# EAGLE design ch340_usb (EAGLE 9.6.2)
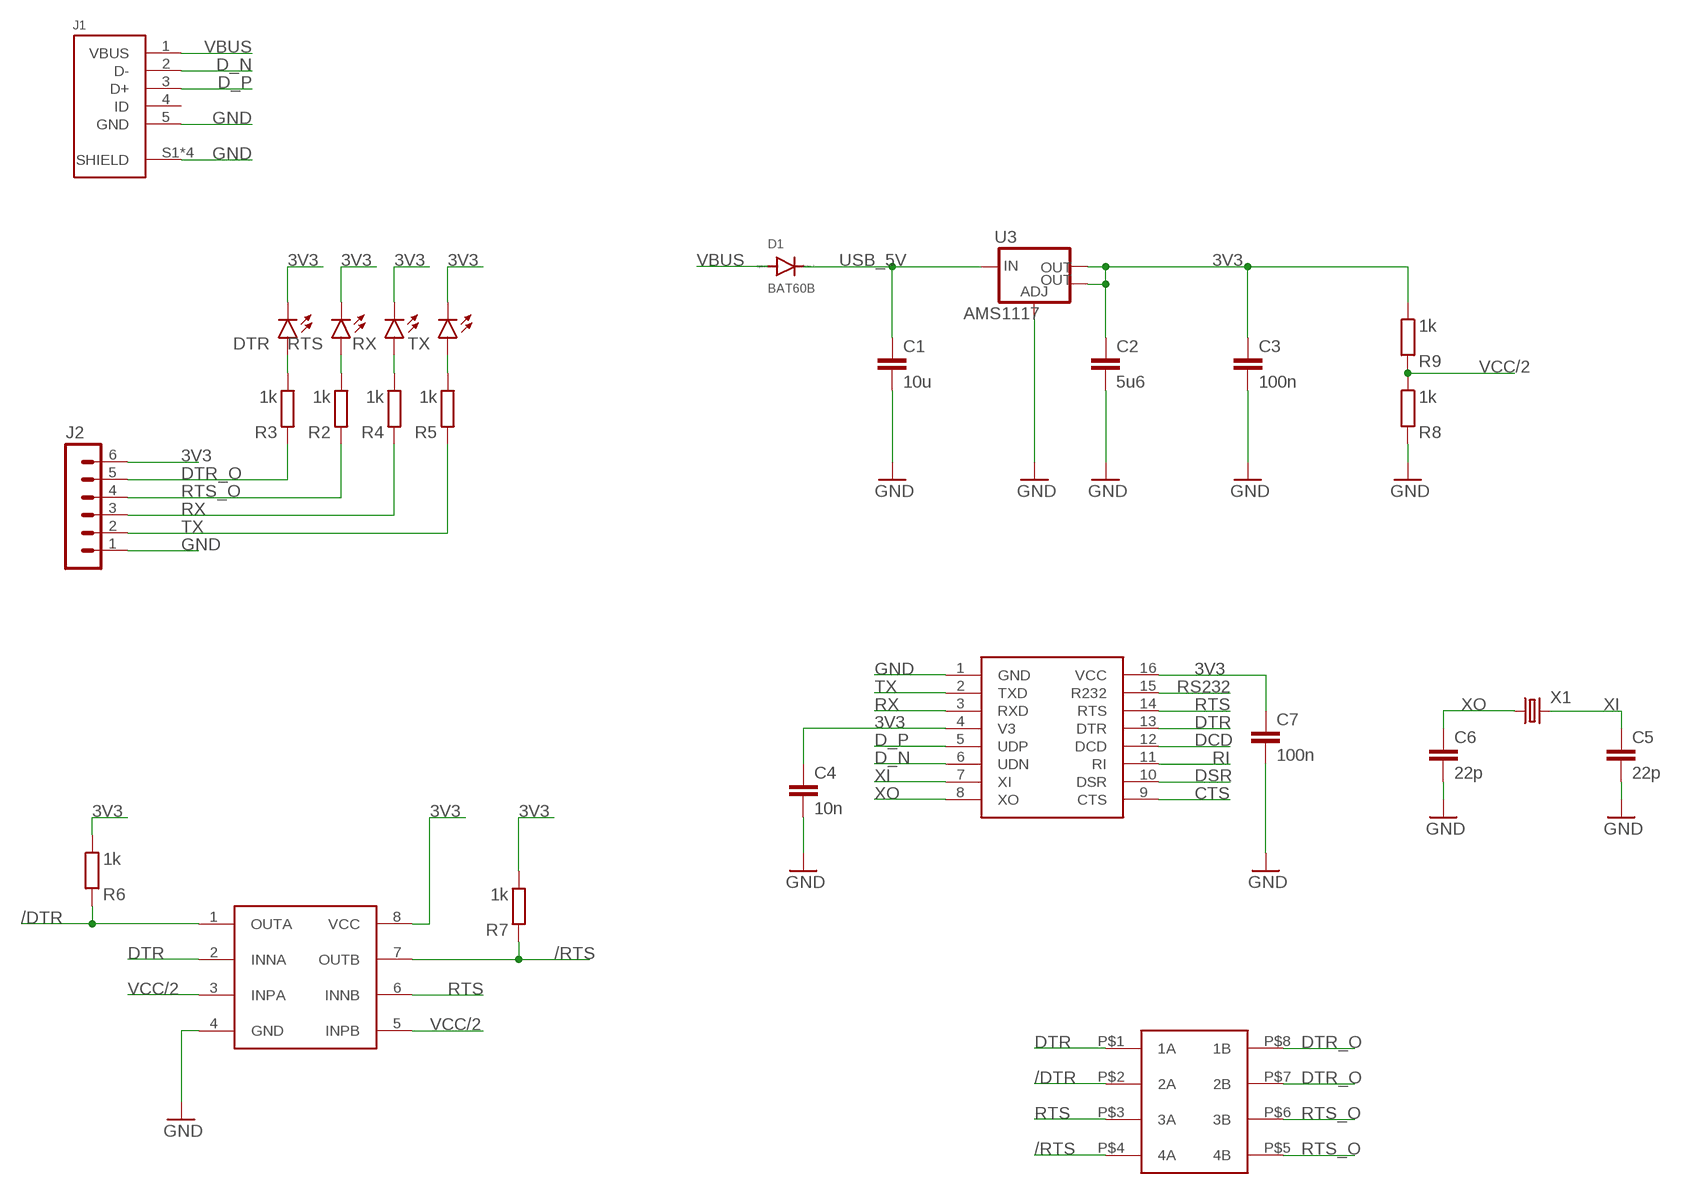
[diagram p0: schematic, sheet 1]

## Parts
C1  10u  C-EUC0805K  [C0805K]
C2  5u6  C-EUC0805K  [C0805K]
C3  100n  C-EUC0805K  [C0805K]
C4  10n  C-EUC0805K  [C0805K]
C5  22p  C-EUC0805K  [C0805K]
C6  22p  C-EUC0805K  [C0805K]
C7  100n  C-EUC0805K  [C0805K]
D1  BAT60B  MBR0520LT  [SOD123]
DTR  PWR  LEDCHIPLED_0805  [CHIPLED_0805]
J1  1734035-4  [1734035-4]
J2  MA06-1  [MA06-1]
R2  1k  R-EU_R0805  [R0805]
R3  1k  R-EU_R0805  [R0805]
R4  1k  R-EU_R0805  [R0805]
R5  1k  R-EU_R0805  [R0805]
R6  1k  R-EU_R0805  [R0805]
R7  1k  R-EU_R0805  [R0805]
R8  1k  R-EU_R0805  [R0805]
R9  1k  R-EU_R0805  [R0805]
RTS  PWR  LEDCHIPLED_0805  [CHIPLED_0805]
RX  PWR  LEDCHIPLED_0805  [CHIPLED_0805]
TX  PWR  LEDCHIPLED_0805  [CHIPLED_0805]
U1  HX711  CH340G  [SOP16]
U2  LM393  [SOIC127P600X144-8]
U3  AMS1117  V_REG_LM1117SOT223  [SOT223]
U$1  DIPSW4  [4_SMT_2.54]
X1  CSM-7X-DU  [CSM-7X-DU]

## Nets
3V3: C2.1 C3.1 C4.1 C7.1 DTR.C J2.6 R6.1 R7.1 R9.1 RTS.C RX.C TX.C U1.4(V3) U1.16(VCC) U2.8(VCC) U3.2(OUT) U3.4(OUT)
/DTR: R6.2 U2.1(OUTA) U$1.P$2(2A)
/RTS: R7.2 U2.7(OUTB) U$1.P$4(4A)
CTS: U1.9(CTS)
D_N [usb]: J1.2(D-) U1.6(UDN)
D_P [usb]: J1.3(D+) U1.5(UDP)
DCD: U1.12(DCD)
DSR: U1.10(DSR)
DTR: U1.13(DTR) U2.2(INNA) U$1.P$1(1A)
DTR_O: J2.5 R3.2 U$1.P$7(2B) U$1.P$8(1B)
GND: C1.2 C2.2 C3.2 C4.2 C5.2 C6.2 C7.2 J1.5(GND) J1.S1(SHIELD) J1.S2(SHIELD) J1.S3(SHIELD) J1.S4(SHIELD) J2.1 R8.2 U1.1(GND) U2.4(GND) U3.1(ADJ)
N$1: DTR.A R3.1
N$2: R2.1 RTS.A
N$3: R4.1 RX.A
N$4: R5.1 TX.A
RI: U1.11(RI)
RS232: U1.15(R232)
RTS: U1.14(RTS) U2.6(INNB) U$1.P$3(3A)
RTS_O: J2.4 R2.2 U$1.P$5(4B) U$1.P$6(3B)
RX: J2.3 R4.2 U1.3(RXD)
TX: J2.2 R5.2 U1.2(TXD)
USB_5V: C1.1 D1.C U3.3(IN)
VBUS: D1.A J1.1(VBUS)
VCC/2: R8.1 R9.2 U2.3(INPA) U2.5(INPB)
XI: C5.1 U1.7(XI) X1.2
XO: C6.1 U1.8(XO) X1.1
Unconnected: J1.4(ID)

## Library data of the parts
C1-C7 = rcl:C-EU: CAPACITOR, European symbol; SPICEPREFIX: C
D1 = diode:MBR0520LT: SCHOTTKY BARRIER RECTIFIER Source: http://onsemi.com .. MBR0520LT1-D.pdf
DTR RTS RX TX = led:LED: LED OSRAM: - CHIPLED LG R971, LG N971, LY N971, LG Q971, LY Q971, LO R971, LY R971 LH N974, LH R974 LS Q976, LO Q976, LY Q976 LO Q996 - Hyper CHIPLED LW Q18S LB Q993, LB Q99A, LB R99A - SideLED LS A670, LO A670, LY A670, LG A670, LP A670 LB A673, LV A673, LT A673, LW A673 LH A674 LY A675 LS A676, LA A676, LO A676, LY A676, LW A676 LS A679, LY A679, LG A679 - Hyper Micro SIDELED® LS Y876, LA Y876, LO Y876, LY Y876 LT Y87S - SmartLED LW L88C, LW L88S LB L89C, LB L89S, LG L890 LS L89K, LO L89K, LY L89K LS L896, LA L896, LO L896, LY L896 - TOPLED LS T670, LO T670, LY T670, LG T670, LP T670 LSG T670, LSP T670, LSY T670, LOP T670, LYG T670 LG T671, LOG T671, LSG T671 LB T673, LV T673, LT T673, LW T673 LH T674 LS T676, LA T676, LO T676, LY T676, LB T676, LH T676, LSB T676, LW T676 LB T67C, LV T67C, LT T67C, LS T67K, LO T67K, LY T67K, LW E67C LS E67B, LA E67B, LO E67B, LY E67B, LB E67C, LV E67C, LT E67C LW T67C LS T679, LY T679, LG T679 LS T770, LO T770, LY T770, LG T770, LP T770 LB T773, LV T773, LT T773, LW T773 LH T774 LS E675, LA E675, LY E675, LS T675 LS T776, LA T776, LO T776, LY T776, LB T776 LHGB T686 LT T68C, LB T68C - Hyper Mini TOPLED® LB M676 - Mini TOPLED Santana® LG M470 LS M47K, LO M47K, LY M47K Source: http://www.osram.convergy.de LUXEON: - LUMILED® LXK2-PW12-R00, LXK2-PW12-S00, LXK2-PW14-U00, LXK2-PW14-V00 LXK2-PM12-R00, LXK2-PM12-S00, LXK2-PM14-U00 LXK2-PE12-Q00, LXK2-PE12-R00, LXK2-PE12-S00, LXK2-PE14-T00, LXK2-PE14-U00 LXK2-PB12-K00, LXK2-PB12-L00, LXK2-PB12-M00, LXK2-PB14-N00, LXK2-PB14-P00, LXK2-PB14-Q00 LXK2-PR12-L00, LXK2-PR12-M00, LXK2-PR14-Q00, LXK2-PR14-R00 LXK2-PD12-Q00, LXK2-PD12-R00, LXK2-PD12-S00 LXK2-PH12-R00, LXK2-PH12-S00 LXK2-PL12-P00, LXK2-PL12-Q00, LXK2-PL12-R00 Source: www.luxeon.com KINGBRIGHT: KA-3528ASYC Source: www.kingbright.com
J1 = USB connector:1734035-4: CONN RCPT USB2.0 MINI B SMD R/A Manufacturer's datasheet <https://www.te.com/commerce/DocumentDelivery/DDEController?Action=srchrtrv&DocNm=1734035&DocType=Customer+Drawing&DocLang=English>; CREATED_BY: PCBLayout.com; DIGIKEY_PARTNO: A121554TR-ND; MANUFACTURER: TE Connectivity AMP Connectors; MPN: 1734035-4
J2 = con-lstb_round_pads:MA06-1: PIN HEADER; OC_FARNELL: unknown; OC_NEWARK: unknown
R2-R9 = rcl:R-EU_: RESISTOR, European symbol; SPICEPREFIX: R
U1 = ch340:CH340G
U2 = lm393:LM393
U3 = SparkFun-IC-Power:V_REG_LM1117: Voltage Regulator LM1117 Standard adjustable voltage regulator but in SMD form. Spark Fun Electronics SKU : COM-00595; PROD_ID: VREG-08170
U$1 = dipsw:DIPSW4
X1 = crystal:CSM-7X-DU: SMD CRYSTAL Source: www.ecsxtal.com .. Crystal 3.6864MHz CSM_7X_DU.PDF; OC_FARNELL: unknown; OC_NEWARK: unknown

## Net classes
1 usb: width 0.254 mm, clearance 0.254 mm

## Board
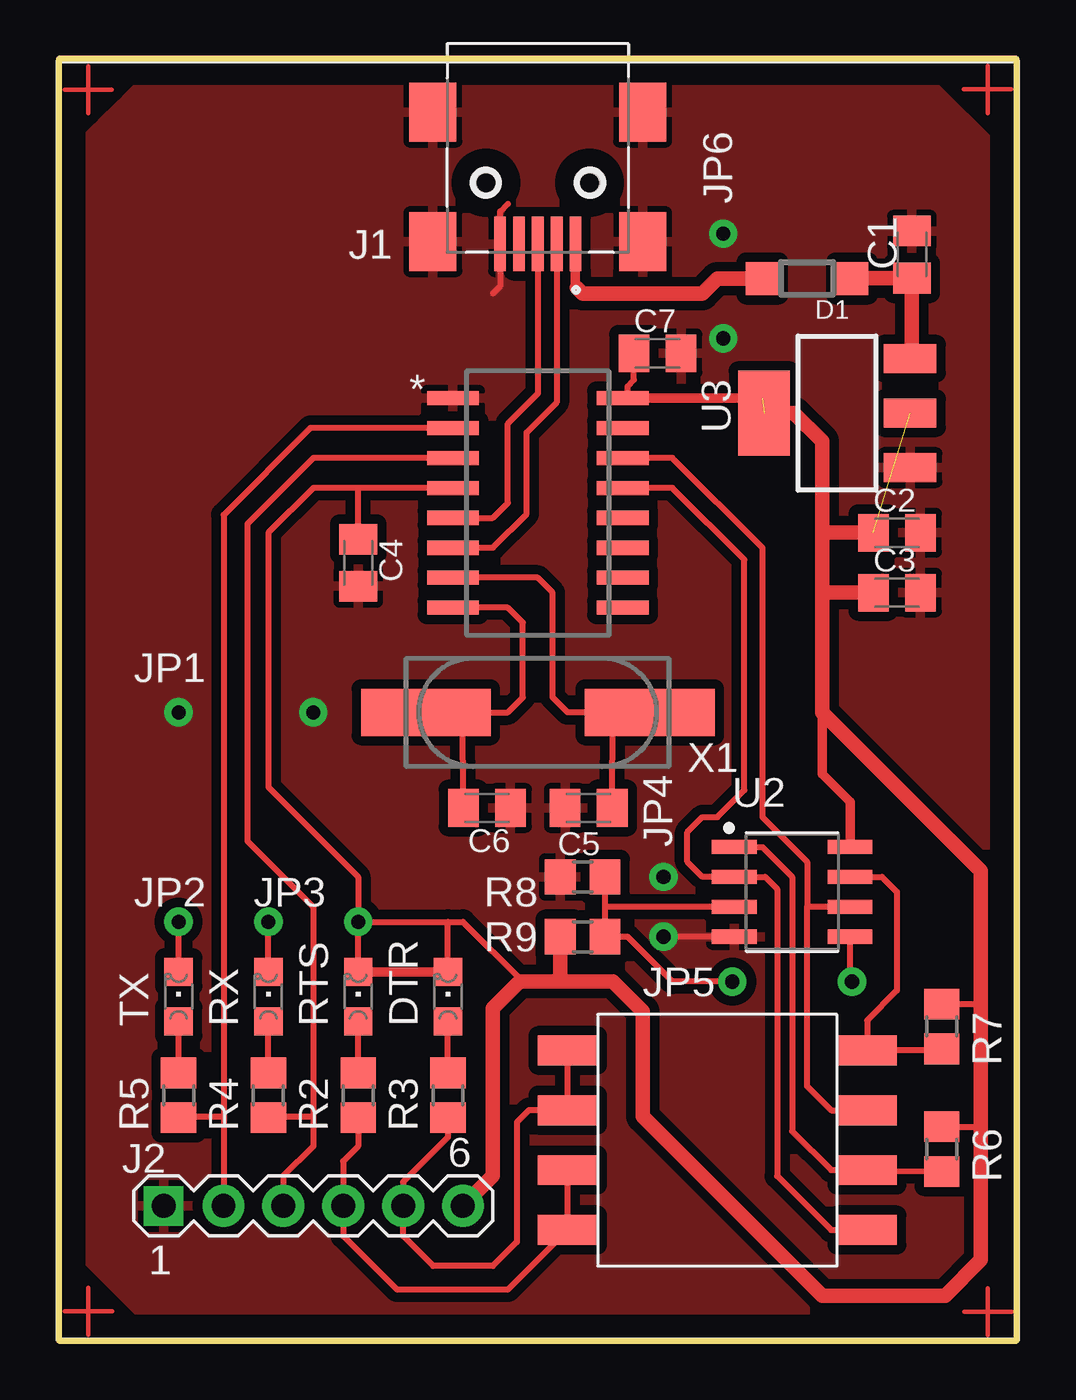
[diagram p1: board, top side]
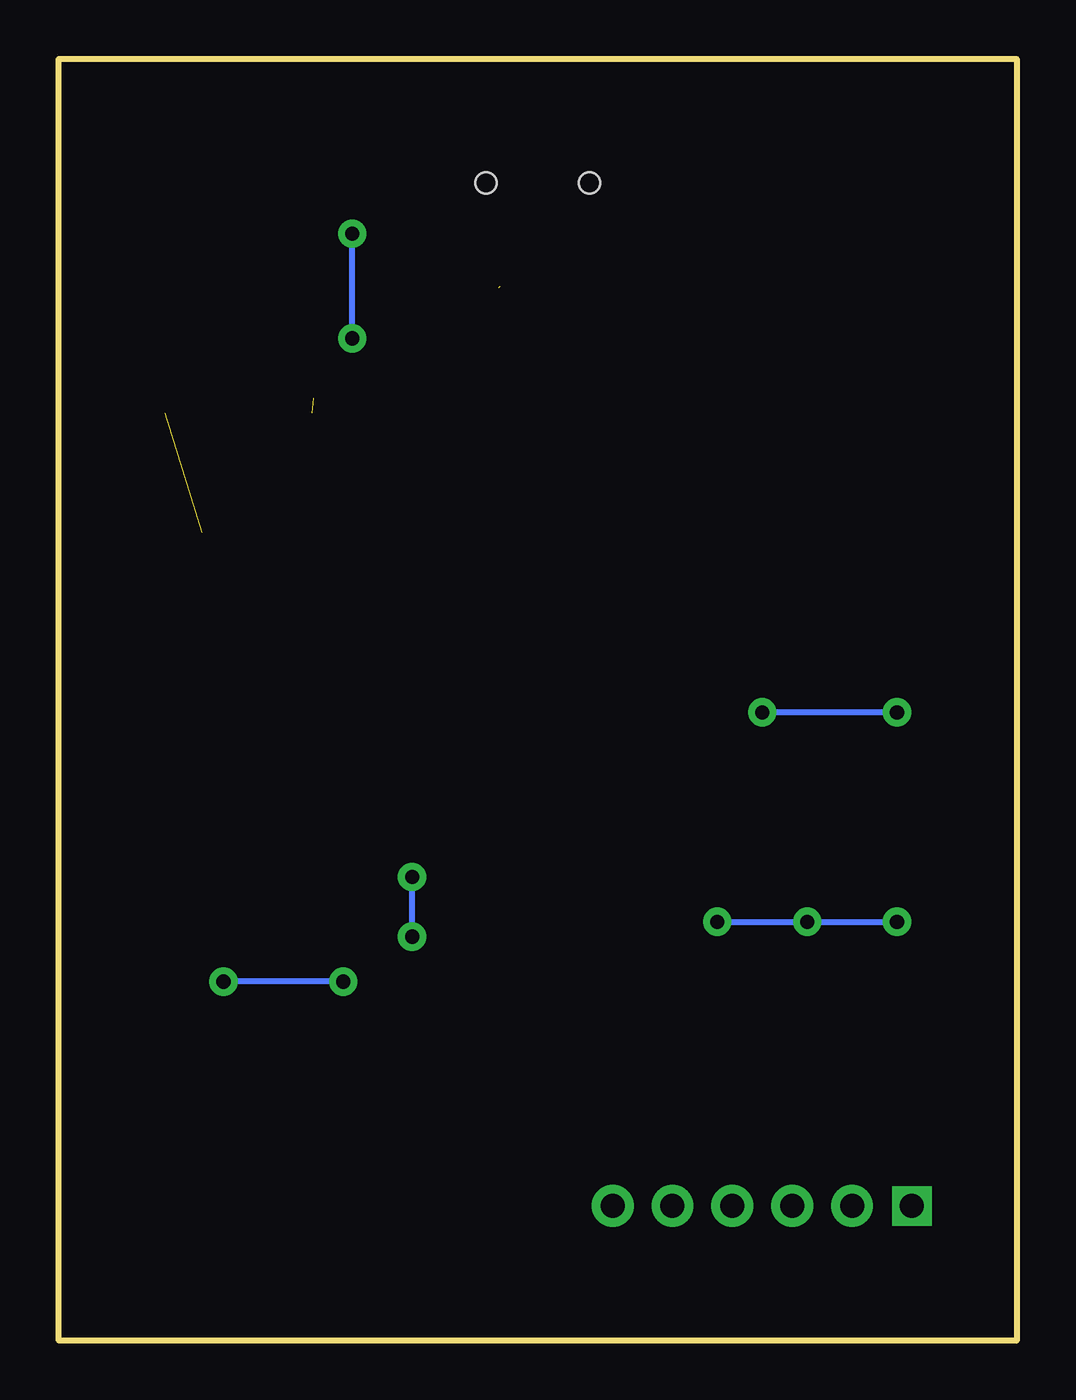
[diagram p2: board, bottom side, seen from below]

Size 40.64 x 54.41 mm. Coordinates in mm from the lower left corner, seen from the top.
Outline: 0,0 40.64,0 40.64,54.41 0,54.41 0,0
Copper layers (1*16): Top 0.035mm / dielectric 1.5mm / Bottom 0.035mm
Design rules "default *": minimum track width 6mil, minimum drill 0.35mm, track to track 6mil, track to pad 6mil, pad to pad 6mil, via to via 6mil, smd to smd 6mil, copper to edge 1mm, drill to drill 6mil, minimum pad ring 10mil, minimum via ring 8mil, stop-mask expansion 4mil, vias tented up to drill 0mil, thermal gap 10mil
tRestrict: 3 lines

### Footprints (pad centres in the part's own frame; a part is rotated, then mirrored left to right if it is on the bottom)
C0805K = smd 1.3 x 1.6: 1 -1,0; 2 1,0
SOD123 = smd 1.4 x 1.4: A 1.9,0; C -1.9,0
CHIPLED_0805 = smd 1.2 x 1.2: A 0,-1.05; C 0,1.05
1734035-4 = smd 0.5 x 2.3: 1 -1.6,2.6; 2 -0.8,2.6; 3 0,2.6; 4 0.8,2.6; 5 1.6,2.6 | smd 2 x 2.5: S1 -4.45,2.5; S2 4.45,2.5; S3 -4.45,-3; S4 4.45,-3 | hole 0.9: -2.2,0; 2.2,0
MA06-1 = drill 1.016 pad 1.676 square: 1 -6.35,0 | drill 1.016 pad 1.778: 2 -3.81,0; 3 -1.27,0; 4 1.27,0; 5 3.81,0; 6 6.35,0
R0805 = smd 1.3 x 1.5: 1 -0.95,0; 2 0.95,0
SOP16 = smd 2.2 x 0.6: 1 -3.6,4.445; 2 -3.6,3.175; 3 -3.6,1.905; 4 -3.6,0.635; 5 -3.6,-0.635; 6 -3.6,-1.905; 7 -3.6,-3.175; 8 -3.6,-4.445; 9 3.6,-4.445; 10 3.6,-3.175; 11 3.6,-1.905; 12 3.6,-0.635; 13 3.6,0.635; 14 3.6,1.905; 15 3.6,3.175; 16 3.6,4.445
SOIC127P600X144-8 = smd 1.901 x 0.599: 1 -2.455,1.905; 2 -2.455,0.635; 3 -2.455,-0.635; 4 -2.455,-1.905; 5 2.455,-1.905; 6 2.455,-0.635; 7 2.455,0.635; 8 2.455,1.905
SOT223 = smd 1.219 x 2.235: 1 -2.311,-3.099; 2 0,-3.099; 3 2.311,-3.099 | smd 3.6 x 2.2: 4 0,3.099
4_SMT_2.54 = smd 2.54 x 1.27: P$1 -1.27,-1.524; P$2 -1.27,-4.064; P$3 -1.27,-6.604; P$4 -1.27,-9.144; P$5 11.43,-1.524; P$6 11.43,-4.064; P$7 11.43,-6.604; P$8 11.43,-9.144
CSM-7X-DU = smd 5.5 x 2: 1 -4.75,0; 2 4.75,0

### Placement (x,y rotation side)
C1  36.2,46.1 90 top
C2  35.56,34.29 0 top
C3  35.56,31.75 0 top
C4  12.7,33.02 270 top
C5  22.48,22.61 180 top
C6  18.16,22.61 0 top
C7  25.4,41.91 0 top
D1  31.75,45.09 180 top
DTR  16.51,14.61 0 top
J1  20.32,49.15 180 top
J2  10.79,5.71 0 top
R2  12.7,10.41 270 top
R3  16.51,10.41 270 top
R4  8.89,10.41 270 top
R5  5.08,10.41 270 top
R6  37.47,8.13 270 top
R7  37.47,13.34 270 top
R8  22.23,19.68 180 top
R9  22.23,17.14 0 top
RTS  12.7,14.61 0 top
RX  8.89,14.61 0 top
TX  5.08,14.61 0 top
U1  20.32,35.56 0 top
U2  31.11,19.05 0 top
U3  33.02,39.37 90 top
U$1  33.02,3.17 180 top
X1  20.32,26.67 0 top

### Tracks (layer width: path | path; a pad name or v marks a point on that pad's centre or on a via)
3V3  (via drill 0.6 pad 1.2)  (2 unrouted)
  Top 0.254: U1.4 12.7,36.2 | 12.7,36.2 10.79,36.2 8.89,34.29 8.89,23.5 12.7,19.68 v12.7,17.78 | C4.1 12.7,36.2 | TX.C v5.08,17.78 | RX.C v8.89,17.78 | RTS.C v12.7,17.78 | DTR.C 16.51,17.78 | v12.7,17.78 16.51,17.78 | 16.51,17.78 17.14,17.78 19.68,15.24 | 22.55,15.31 22.48,15.24 | U1.16 24.13,40.22 24.13,40.51 24.4,40.78 C7.1 | R7.1 39.09,14.29 39.12,14.25 | R6.1 39.04,9.08 39.12,9
  Top 0.406: 29.84,39.37 U3.4 | RTS.C DTR.C | U1.16 29.84,40.01 | U2.8 33.57,22.86 32.38,24.05 32.38,26.67
  Top 0.61: 21.34,15.24 22.48,15.24 23.5,15.24 24.77,13.97 24.77,9.53 32.38,1.91 37.6,1.91 39.12,3.42 39.12,9 39.12,14.25 39.12,19.93 32.38,26.67 32.38,31.75 | 21.34,15.24 19.68,15.24 19.56,15.24 18.41,14.09 18.41,6.99 J2.6 | U3.4 31.19,39.37 32.38,38.18 32.38,34.29 | 32.38,34.29 32.38,31.75 | C2.1 32.38,34.29 | C3.1 32.38,31.75 | R9.1 21.27,15.3 21.34,15.24
  Bottom 0.254: v5.08,17.78 v8.89,17.78 v12.7,17.78
/DTR
  Top 0.254: U2.1 29.84,20.95 31.11,19.68 31.11,8.89 32.77,7.24 U$1.P$2 34.36,7.17 R6.2
/RTS
  Top 0.254: U2.7 34.92,19.68 35.56,19.05 35.56,14.86 34.29,13.59 U$1.P$4 37.4,12.32 R7.2
D_N
  Top 0.254: J1.2 21.12,39.82 19.85,38.55 19.85,35.09 18.41,33.66 U1.6
D_P
  Top 0.254: J1.3 20.32,40.2 19.05,38.93 19.05,35.56 18.41,34.92 U1.5
DTR
  Top 0.254: U$1.P$1 32.77,4.7 30.48,6.99 30.48,19.18 29.97,19.68 U2.2 27.3,19.68 26.67,20.32 26.67,21.59 27.3,22.23 27.94,22.23 29.08,23.37 29.08,33.15 26.04,36.2 U1.13
DTR_O
  Top 0.254: R3.2 16.51,8.64 14.61,6.73 J2.5 14.61,4.45 15.88,3.17 18.41,3.17 19.43,4.19 19.43,9.27 19.94,9.78 U$1.P$7 | U$1.P$7 21.34,9.53 | 21.08,10.29 U$1.P$7 | U$1.P$7 U$1.P$8
GND  (via drill 0.6 pad 1.2)
  Top 0.254: U2.4 v25.65,17.14 | 19.05,48.26 18.72,47.93 J1.5 18.72,44.76 18.41,44.45
  Bottom 0.254: v25.65,17.14 v25.65,19.68 | v5.08,26.67 v10.79,26.67 | v28.19,42.55 v28.19,46.99
  pour Top (isolate 0.406, rank 2): 0,54.36 0,0 40.64,0 40.64,54.36
N$1
  Top 0.254: R3.1 DTR.A
N$2
  Top 0.254: R2.1 RTS.A
N$3
  Top 0.254: R4.1 RX.A
N$4
  Top 0.254: R5.1 TX.A
N$5
  Top 0.2: 1.25,54.09 1.25,52.09
N$6
  Top 0.2: 0.24,53.09 2.25,53.09
N$7
  Top 0.2: 39.4,54.11 39.4,52.11
N$8
  Top 0.2: 38.4,53.11 40.4,53.11
N$9
  Top 0.2: 1.25,2.25 1.25,0.24
N$10
  Top 0.2: 0.25,1.25 2.25,1.25
N$11
  Top 0.2: 39.42,2.22 39.42,0.22
N$12
  Top 0.2: 38.42,1.22 40.42,1.22
RTS
  Top 0.254: 31.75,18.41 31.75,10.79 32.77,9.78 U$1.P$3 | U2.6 31.75,18.41 | U1.14 26.04,37.47 29.84,33.66 29.84,22.23 31.75,20.32 31.75,18.41
RTS_O
  Top 0.254: R2.2 12.7,8.26 12.06,7.62 J2.4 12.06,4.45 14.35,2.16 19.05,2.16 U$1.P$5 U$1.P$6
RX
  Top 0.254: J2.3 9.53,6.99 10.79,8.26 10.79,9.53 | 10.79,9.53 10.79,18.41 8,21.21 8,34.67 10.79,37.47 U1.3 | R4.2 8.95,9.53 10.79,9.53
TX
  Top 0.254: 6.99,6.99 J2.2 6.99,9.53 | R5.2 5.14,9.53 6.99,9.53 | U1.2 10.67,38.73 6.99,35.05 6.99,9.53
USB_5V
  Top 0.61: D1.C 33.67,45.1 C1.1 36.2,41.76 U3.3
VBUS  (1 unrouted)
  Top 0.406: J1.1 21.92,44.76
  Top 0.61: 21.97,44.7 22.23,44.45 27.3,44.45 27.94,45.09 D1.A
VCC/2  (via drill 0.6 pad 1.2)
  Top 0.254: U2.3 23.18,18.41 | v33.66,15.24 33.57,15.32 U2.5 | 23.18,18.41 R9.2 24.13,17.14 26.04,15.24 v28.57,15.24 | 23.18,18.41 R8.1
  Bottom 0.254: v28.57,15.24 v33.66,15.24
XI
  Top 0.254: X1.2 23.5,26.67 | 23.5,26.67 21.59,26.67 20.95,27.3 20.95,31.75 20.32,32.38 U1.7 | C5.1 23.5,26.67
XO
  Top 0.254: X1.1 17.14,26.67 | 17.14,26.67 19.05,26.67 19.68,27.3 19.68,30.48 19.05,31.11 U1.8 | C6.1 17.14,26.67

### Text on the board
tNames: JP6 | JP1 | JP4 | JP2 | JP3 | JP5